# Altium project Ampli_UHF.PrjPcb
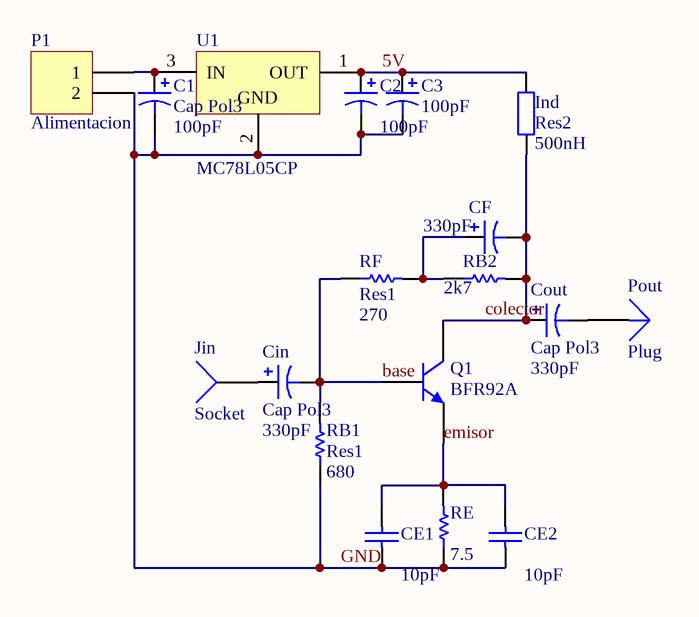
[diagram p0: Ampli_ancha.SchDoc]
5 sheets, 81 parts. Net scope: global (net labels, ports and power ports of the same name join across sheets).
Board files: Ampli2.PcbDoc, Ampli.PcbDoc
Sheets:
  Ampli_ancha.SchDoc
  Ampli2.SchDoc
  Ampli3.SchDoc
  Ampli4.SchDoc
  Alimentacion.SchDoc

## Sheet Ampli_ancha.SchDoc
size A4

### Parts
C1  Cap Pol3  value 100pF  [C0805]
C2  value 100pF  [C0805]  (hidden comment: Cap Pol3)
C3  value 100pF  [C0805]  (hidden comment: Cap Pol3)
CE1  value 10pF  [1608[0603]]  (hidden comment: Cap Semi)
CE2  value 10pF  [1608[0603]]  (hidden comment: Cap Semi)
CF  value 330pF  [C0805]  (hidden comment: Cap Pol3)
Cin  Cap Pol3  value 330pF  [C0805]
Cout  Cap Pol3  value 330pF  [C0805]
Ind  Res2  value 500nH  [AXIAL-0.4]
Jin  Socket  [PIN1]
P1  Alimentacion  [HDR1X2]
Pout  Plug  [PIN1]
Q1  BFR92A  [SOT23]
RB1  Res1  value 680  [AXIAL-0.3]
RB2  value 2k7  [AXIAL-0.3]  (hidden comment: Res1)
RE  value 7.5  [2012[0805]]  (hidden comment: Res Semi)
RF  Res1  value 270  [AXIAL-0.3]
U1  MC78L05CP  [29-04]

### Nets
5V: C2.1 C3.1 Ind.2 U1.1(OUT)
base: Cin.2 Q1.1(B) RB1.2 RF.1
colector: CF.2 Cout.1 Ind.1 Q1.3(C) RB2.2
emisor: CE1.2 CE2.2 Q1.2(E) RE.2
GND: C1.2 C2.2 C3.2 CE1.1 CE2.1 P1.2 RB1.1 RE.1 U1.2(GND)
NetC1_1: C1.1 P1.1 U1.3(IN)
NetCF_1: CF.1 RB2.1 RF.2
NetCin_1: Cin.1 Jin.1
NetCout_2: Cout.2 Pout.1

### Library data of the parts
C1-C3 CF Cin Cout = Cap Pol3: Polarized Capacitor (Surface Mount); Published: 8-Jun-2000; LatestRevisionDate: 17-Jul-2002; LatestRevisionNote: Re-released for DXP Platform.; PackageReference: C0805; Publisher: Altium Limited
CE1 CE2 = Cap Semi: Capacitor (Semiconductor SIM Model); Published: 8-Jun-2000; LatestRevisionDate: 17-Jul-2002; LatestRevisionNote: Re-released for DXP Platform.; PackageReference: C1206; Publisher: Altium Limited
Ind = Res2: Resistor; Published: 8-Jun-2000; LatestRevisionDate: 17-Jul-2002; LatestRevisionNote: Re-released for DXP Platform.; PackageReference: AXIAL-0.4; Publisher: Altium Limited
P1 = Header 2: Header, 2-Pin; LatestRevisionDate: 17-Jul-2002; LatestRevisionNote: Re-released for DXP Platform.; Publisher: Altium Limited
Q1 = BFR92A: NPN 5 GHz Wideband Transistor; Published: 17-Sep-2003; DatasheetDocument: 29-Oct-1997; PackageDocument: May-1999; PackageReference: SOT23; Publisher: Altium Limited; ComponentLink1Description: Manufacturer Link; ComponentLink1URL: http://www.semiconductors.philips.com/; ComponentLink2Description: Datasheet; ComponentLink2URL: http://www.semiconductors.philips.com/acrobat/datasheets/BFR92A_2.pdf
RB1 RB2 RF = Res1: Resistor; Published: 8-Jun-2000; LatestRevisionDate: 17-Jul-2002; LatestRevisionNote: Re-released for DXP Platform.; PackageReference: AXIAL-0.3; Publisher: Altium Limited
RE = Res Semi: Semiconductor Resistor; Published: 8-Jun-2000; LatestRevisionDate: 17-Jul-2002; LatestRevisionNote: Re-released for DXP Platform.; PackageReference: AXIAL-0.5; Publisher: Altium Limited
U1 = MC78L05CP: 3-Terminal Low-Current Positive Fixed Voltage Regulator; PackageDocument: 1996; Published: 17-Jul-2002; DatasheetDocument: 1988; PackageReference: 29-04; Publisher: Altium Limited; ComponentLink1Description: Manufacturer Link; ComponentLink1URL: http://www.onsemi.com/site/products/taxonomy/0,4438,503,00.html; ComponentLink2Description: Datasheet; ComponentLink2URL: http://www.onsemi.com/pub/Collateral/MC78L00A-D.PDF
Jin = Socket: LatestRevisionDate: 17-Jul-2002; LatestRevisionNote: Re-released for DXP Platform.; Publisher: Altium Limited
Pout = Plug: LatestRevisionDate: 17-Jul-2002; LatestRevisionNote: Re-released for DXP Platform.; Publisher: Altium Limited

## Sheet Ampli2.SchDoc
size A4
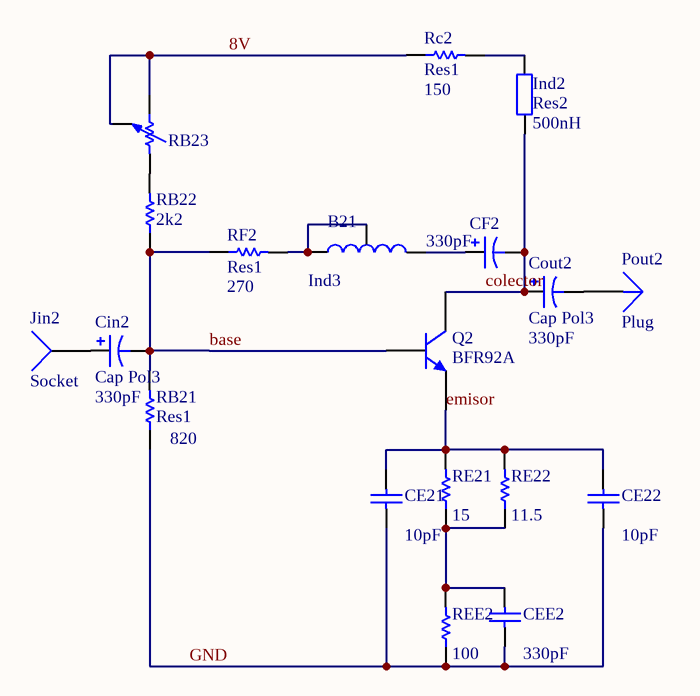
[diagram p1: Ampli2.SchDoc]

### Parts
B21  Ind3  [Ind 7mm]
CE21  value 10pF  [1608[0603]]  (hidden comment: Cap Semi)
CE22  value 10pF  [1608[0603]]  (hidden comment: Cap Semi)
CEE2  value 330pF  [1608[0603]]  (hidden comment: Cap Semi)
CF2  value 330pF  [C0805]  (hidden comment: Cap Pol3)
Cin2  Cap Pol3  value 330pF  [C0805]
Cout2  Cap Pol3  value 330pF  [C0805]
Ind2  Res2  value 500nH  [AXIAL-0.4]
Jin2  Socket  [PIN1]
Pout2  Plug  [PIN1]
Q2  BFR92A  [SOT23]
RB21  Res1  value 820  [AXIAL-0.3]
RB22  value 2k2  [AXIAL-0.3]  (hidden comment: Res1)
RB23  Pot  [Potenciometro]  (value not drawn)
Rc2  Res1  value 150  [AXIAL-0.3]
RE21  value 15  [1608[0603]]  (hidden comment: Res Semi)
RE22  value 11.5  [2012[0805]]  (hidden comment: Res Semi)
REE2  value 100  [2012[0805]]  (hidden comment: Res Semi)
RF2  Res1  value 270  [AXIAL-0.3]

### Nets
8V: RB23.2 RB23.3 Rc2.1
base: Cin2.2 Q2.1(B) RB21.2 RB22.1 RF2.1
colector: CF2.2 Cout2.1 Ind2.1 Q2.3(C)
emisor: CE21.2 CE22.2 Q2.2(E) RE21.2 RE22.2
GND: CE21.1 CE22.1 CEE2.1 RB21.1 REE2.1
NetB21_0: B21.0 B21.2 RF2.2
NetB21_1: B21.1 CF2.1
NetCEE2_2: CEE2.2 RE21.1 RE22.1 REE2.2
NetCin2_1: Cin2.1 Jin2.1
NetCout2_2: Cout2.2 Pout2.1
NetInd2_2: Ind2.2 Rc2.2
NetRB22_2: RB22.2 RB23.1

### Library data of the parts
CE21 CE22 CEE2 = Cap Semi: Capacitor (Semiconductor SIM Model); Published: 8-Jun-2000; LatestRevisionDate: 17-Jul-2002; LatestRevisionNote: Re-released for DXP Platform.; PackageReference: C1206; Publisher: Altium Limited
CF2 Cin2 Cout2 = Cap Pol3: Polarized Capacitor (Surface Mount); Published: 8-Jun-2000; LatestRevisionDate: 17-Jul-2002; LatestRevisionNote: Re-released for DXP Platform.; PackageReference: C0805; Publisher: Altium Limited
Ind2 = Res2: Resistor; Published: 8-Jun-2000; LatestRevisionDate: 17-Jul-2002; LatestRevisionNote: Re-released for DXP Platform.; PackageReference: AXIAL-0.4; Publisher: Altium Limited
Q2 = BFR92A: NPN 5 GHz Wideband Transistor; Published: 17-Sep-2003; DatasheetDocument: 29-Oct-1997; PackageDocument: May-1999; PackageReference: SOT23; Publisher: Altium Limited; ComponentLink1Description: Manufacturer Link; ComponentLink1URL: http://www.semiconductors.philips.com/; ComponentLink2Description: Datasheet; ComponentLink2URL: http://www.semiconductors.philips.com/acrobat/datasheets/BFR92A_2.pdf
RB21 RB22 Rc2 RF2 = Res1: Resistor; Published: 8-Jun-2000; LatestRevisionDate: 17-Jul-2002; LatestRevisionNote: Re-released for DXP Platform.; PackageReference: AXIAL-0.3; Publisher: Altium Limited
RE21 RE22 REE2 = Res Semi: Semiconductor Resistor; Published: 8-Jun-2000; LatestRevisionDate: 17-Jul-2002; LatestRevisionNote: Re-released for DXP Platform.; PackageReference: AXIAL-0.5; Publisher: Altium Limited
Jin2 = Socket: LatestRevisionDate: 17-Jul-2002; LatestRevisionNote: Re-released for DXP Platform.; Publisher: Altium Limited
Pout2 = Plug: LatestRevisionDate: 17-Jul-2002; LatestRevisionNote: Re-released for DXP Platform.; Publisher: Altium Limited

## Sheet Ampli3.SchDoc
size A4
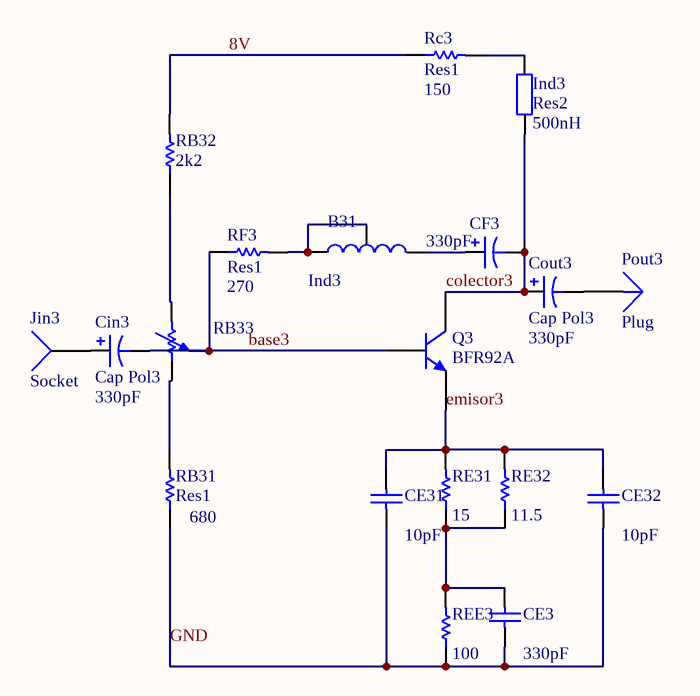
[diagram p2: Ampli3.SchDoc]

### Parts
B31  Ind3  [Ind 7mm]
CE3  value 330pF  [1608[0603]]  (hidden comment: Cap Semi)
CE31  value 10pF  [1608[0603]]  (hidden comment: Cap Semi)
CE32  value 10pF  [1608[0603]]  (hidden comment: Cap Semi)
CF3  value 330pF  [C0805]  (hidden comment: Cap Pol3)
Cin3  Cap Pol3  value 330pF  [C0805]
Cout3  Cap Pol3  value 330pF  [C0805]
Ind3  Res2  value 500nH  [AXIAL-0.4]
Jin3  Socket  [PIN1]
Pout3  Plug  [PIN1]
Q3  BFR92A  [SOT23]
RB31  Res1  value 680  [AXIAL-0.3]
RB32  value 2k2  [AXIAL-0.3]  (hidden comment: Res1)
RB33  Pot  [Potenciometro]  (value not drawn)
Rc3  Res1  value 150  [AXIAL-0.3]
RE31  value 15  [1608[0603]]  (hidden comment: Res Semi)
RE32  value 11.5  [2012[0805]]  (hidden comment: Res Semi)
REE3  value 100  [2012[0805]]  (hidden comment: Res Semi)
RF3  Res1  value 270  [AXIAL-0.3]

### Nets
8V: RB32.2 Rc3.1
base3: Cin3.2 Q3.1(B) RB33.3 RF3.1
colector3: CF3.2 Cout3.1 Ind3.1 Q3.3(C)
emisor3: CE31.2 CE32.2 Q3.2(E) RE31.2 RE32.2
GND: CE3.1 CE31.1 CE32.1 RB31.1 REE3.1
NetB31_0: B31.0 B31.2 RF3.2
NetB31_1: B31.1 CF3.1
NetCE3_2: CE3.2 RE31.1 RE32.1 REE3.2
NetCin3_1: Cin3.1 Jin3.1
NetCout3_2: Cout3.2 Pout3.1
NetInd3_2: Ind3.2 Rc3.2
NetRB31_2: RB31.2 RB33.2
NetRB32_1: RB32.1 RB33.1

### Library data of the parts
CE3 CE31 CE32 = Cap Semi: Capacitor (Semiconductor SIM Model); Published: 8-Jun-2000; LatestRevisionDate: 17-Jul-2002; LatestRevisionNote: Re-released for DXP Platform.; PackageReference: C1206; Publisher: Altium Limited
CF3 Cin3 Cout3 = Cap Pol3: Polarized Capacitor (Surface Mount); Published: 8-Jun-2000; LatestRevisionDate: 17-Jul-2002; LatestRevisionNote: Re-released for DXP Platform.; PackageReference: C0805; Publisher: Altium Limited
Ind3 = Res2: Resistor; Published: 8-Jun-2000; LatestRevisionDate: 17-Jul-2002; LatestRevisionNote: Re-released for DXP Platform.; PackageReference: AXIAL-0.4; Publisher: Altium Limited
Q3 = BFR92A: NPN 5 GHz Wideband Transistor; Published: 17-Sep-2003; DatasheetDocument: 29-Oct-1997; PackageDocument: May-1999; PackageReference: SOT23; Publisher: Altium Limited; ComponentLink1Description: Manufacturer Link; ComponentLink1URL: http://www.semiconductors.philips.com/; ComponentLink2Description: Datasheet; ComponentLink2URL: http://www.semiconductors.philips.com/acrobat/datasheets/BFR92A_2.pdf
RB31 RB32 Rc3 RF3 = Res1: Resistor; Published: 8-Jun-2000; LatestRevisionDate: 17-Jul-2002; LatestRevisionNote: Re-released for DXP Platform.; PackageReference: AXIAL-0.3; Publisher: Altium Limited
RE31 RE32 REE3 = Res Semi: Semiconductor Resistor; Published: 8-Jun-2000; LatestRevisionDate: 17-Jul-2002; LatestRevisionNote: Re-released for DXP Platform.; PackageReference: AXIAL-0.5; Publisher: Altium Limited
Jin3 = Socket: LatestRevisionDate: 17-Jul-2002; LatestRevisionNote: Re-released for DXP Platform.; Publisher: Altium Limited
Pout3 = Plug: LatestRevisionDate: 17-Jul-2002; LatestRevisionNote: Re-released for DXP Platform.; Publisher: Altium Limited

## Sheet Ampli4.SchDoc
size A4
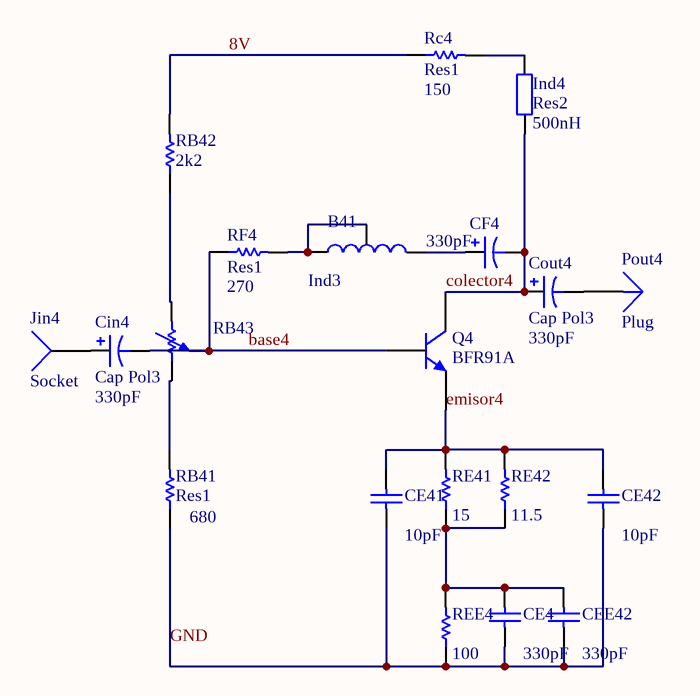
[diagram p3: Ampli4.SchDoc]

### Parts
B41  Ind3  [Ind 7mm]
CE4  value 330pF  [1608[0603]]  (hidden comment: Cap Semi)
CE41  value 10pF  [1608[0603]]  (hidden comment: Cap Semi)
CE42  value 10pF  [1608[0603]]  (hidden comment: Cap Semi)
CEE42  value 330pF  [1608[0603]]  (hidden comment: Cap Semi)
CF4  value 330pF  [C0805]  (hidden comment: Cap Pol3)
Cin4  Cap Pol3  value 330pF  [C0805]
Cout4  Cap Pol3  value 330pF  [C0805]
Ind4  Res2  value 500nH  [AXIAL-0.4]
Jin4  Socket  [PIN1]
Pout4  Plug  [PIN1]
Q4  BFR91A  [SOT-37_short]
RB41  Res1  value 680  [AXIAL-0.3]
RB42  value 2k2  [AXIAL-0.3]  (hidden comment: Res1)
RB43  Pot  [Potenciometro]  (value not drawn)
Rc4  Res1  value 150  [AXIAL-0.3]
RE41  value 15  [1608[0603]]  (hidden comment: Res Semi)
RE42  value 11.5  [2012[0805]]  (hidden comment: Res Semi)
REE4  value 100  [2012[0805]]  (hidden comment: Res Semi)
RF4  Res1  value 270  [AXIAL-0.3]

### Nets
8V: RB42.2 Rc4.1
base4: Cin4.2 Q4.0(B) RB43.3 RF4.1
colector4: CF4.2 Cout4.1 Ind4.1 Q4.2(C)
emisor4: CE41.2 CE42.2 Q4.1(E) RE41.2 RE42.2
GND: CE4.1 CE41.1 CE42.1 CEE42.1 RB41.1 REE4.1
NetB41_0: B41.0 B41.2 RF4.2
NetB41_1: B41.1 CF4.1
NetCE4_2: CE4.2 CEE42.2 RE41.1 RE42.1 REE4.2
NetCin4_1: Cin4.1 Jin4.1
NetCout4_2: Cout4.2 Pout4.1
NetInd4_2: Ind4.2 Rc4.2
NetRB41_2: RB41.2 RB43.2
NetRB42_1: RB42.1 RB43.1

### Library data of the parts
CE4 CE41 CE42 CEE42 = Cap Semi: Capacitor (Semiconductor SIM Model); Published: 8-Jun-2000; LatestRevisionDate: 17-Jul-2002; LatestRevisionNote: Re-released for DXP Platform.; PackageReference: C1206; Publisher: Altium Limited
CF4 Cin4 Cout4 = Cap Pol3: Polarized Capacitor (Surface Mount); Published: 8-Jun-2000; LatestRevisionDate: 17-Jul-2002; LatestRevisionNote: Re-released for DXP Platform.; PackageReference: C0805; Publisher: Altium Limited
Ind4 = Res2: Resistor; Published: 8-Jun-2000; LatestRevisionDate: 17-Jul-2002; LatestRevisionNote: Re-released for DXP Platform.; PackageReference: AXIAL-0.4; Publisher: Altium Limited
Q4 = BFR92A: NPN 5 GHz Wideband Transistor; Published: 17-Sep-2003; DatasheetDocument: 29-Oct-1997; PackageDocument: May-1999; PackageReference: SOT23; Publisher: Altium Limited; ComponentLink1Description: Manufacturer Link; ComponentLink1URL: http://www.semiconductors.philips.com/; ComponentLink2Description: Datasheet; ComponentLink2URL: http://www.semiconductors.philips.com/acrobat/datasheets/BFR92A_2.pdf
RB41 RB42 Rc4 RF4 = Res1: Resistor; Published: 8-Jun-2000; LatestRevisionDate: 17-Jul-2002; LatestRevisionNote: Re-released for DXP Platform.; PackageReference: AXIAL-0.3; Publisher: Altium Limited
RE41 RE42 REE4 = Res Semi: Semiconductor Resistor; Published: 8-Jun-2000; LatestRevisionDate: 17-Jul-2002; LatestRevisionNote: Re-released for DXP Platform.; PackageReference: AXIAL-0.5; Publisher: Altium Limited
Jin4 = Socket: LatestRevisionDate: 17-Jul-2002; LatestRevisionNote: Re-released for DXP Platform.; Publisher: Altium Limited
Pout4 = Plug: LatestRevisionDate: 17-Jul-2002; LatestRevisionNote: Re-released for DXP Platform.; Publisher: Altium Limited

## Sheet Alimentacion.SchDoc
size A4
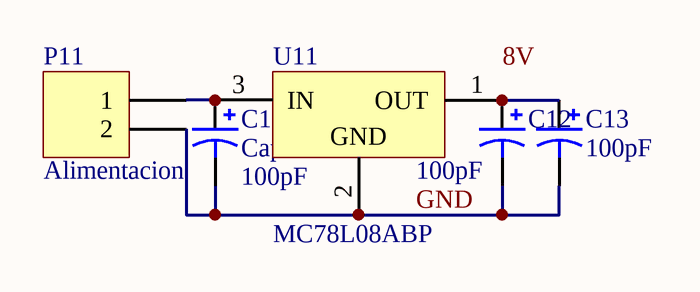
[diagram p4: Alimentacion.SchDoc]

### Parts
C11  Cap Pol3  value 100pF  [C0805]
C12  value 100pF  [C0805]  (hidden comment: Cap Pol3)
C13  value 100pF  [C0805]  (hidden comment: Cap Pol3)
P11  Alimentacion  [HDR1X2]
U11  MC78L08ABP  [29-04]

### Nets
GND: C11.2 C12.2 C13.2 P11.2 U11.2(GND)
NetC11_1: C11.1 P11.1 U11.3(IN)
NetC12_1: C12.1 C13.1 U11.1(OUT)

### Notes on the sheet
- Labels drawn without touching a wire or pin: 8V

### Library data of the parts
C11-C13 = Cap Pol3: Polarized Capacitor (Surface Mount); Published: 8-Jun-2000; LatestRevisionDate: 17-Jul-2002; LatestRevisionNote: Re-released for DXP Platform.; PackageReference: C0805; Publisher: Altium Limited
P11 = Header 2: Header, 2-Pin; LatestRevisionDate: 17-Jul-2002; LatestRevisionNote: Re-released for DXP Platform.; Publisher: Altium Limited
U11 = MC78L08ABP: 3-Terminal Low-Current Positive Fixed Voltage Regulator; PackageDocument: 1996; Published: 17-Jul-2002; DatasheetDocument: 1988; PackageReference: 29-04; Publisher: Altium Limited; ComponentLink1Description: Manufacturer Link; ComponentLink1URL: http://www.onsemi.com/site/products/taxonomy/0,4438,503,00.html; ComponentLink2Description: Datasheet; ComponentLink2URL: http://www.onsemi.com/pub/Collateral/MC78L00A-D.PDF

## Nets that join several sheets
8V: Ampli2 (RB23.2 RB23.3 Rc2.1), Ampli3 (RB32.2 Rc3.1), Ampli4 (RB42.2 Rc4.1)
base: Ampli_ancha (Cin.2 Q1.1 RB1.2 RF.1), Ampli2 (5 pins)
colector: Ampli_ancha (5 pins), Ampli2 (CF2.2 Cout2.1 Ind2.1 Q2.3)
emisor: Ampli_ancha (CE1.2 CE2.2 Q1.2 RE.2), Ampli2 (5 pins)
GND: Ampli_ancha (9 pins), Ampli2 (5 pins), Ampli3 (5 pins), Ampli4 (6 pins), Alimentacion (5 pins)